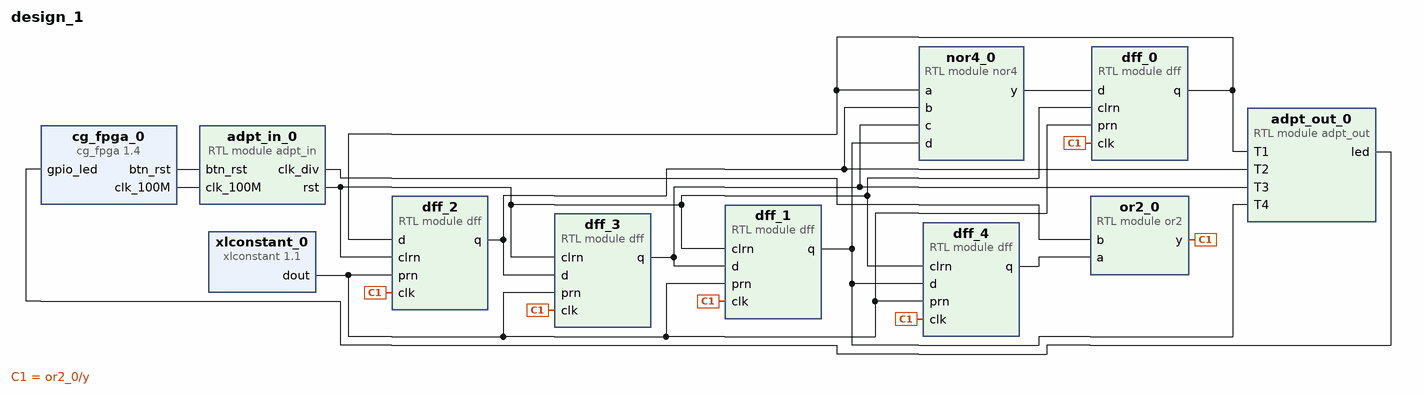
[diagram p0: block diagram of the top level]
# Vivado block design design_1, xc7z020clg400-1, Vivado 2024.2
create_bd_design design_1

create_bd_cell -type ip -vlnv educg.net:user:cg_fpga:1.4 cg_fpga_0
create_bd_cell -type module -reference adpt_in adpt_in_0
create_bd_cell -type module -reference dff dff_0
create_bd_cell -type module -reference dff dff_1
create_bd_cell -type module -reference dff dff_2
create_bd_cell -type module -reference dff dff_3
create_bd_cell -type module -reference adpt_out adpt_out_0
create_bd_cell -type ip -vlnv xilinx.com:ip:xlconstant:1.1 xlconstant_0
create_bd_cell -type module -reference nor4 nor4_0
create_bd_cell -type module -reference or2 or2_0
create_bd_cell -type module -reference dff dff_4

# ---- connections ----

connect_bd_net [get_bd_pins adpt_in_0/clk_div] [get_bd_pins or2_0/b]
connect_bd_net [get_bd_pins adpt_in_0/rst] \
  [get_bd_pins dff_2/clrn] [get_bd_pins dff_3/clrn] [get_bd_pins dff_1/clrn] [get_bd_pins dff_4/clrn] \
  [get_bd_pins dff_0/clrn]
connect_bd_net [get_bd_pins adpt_out_0/led] [get_bd_pins cg_fpga_0/gpio_led]
connect_bd_net [get_bd_pins cg_fpga_0/btn_rst] [get_bd_pins adpt_in_0/btn_rst]
connect_bd_net [get_bd_pins cg_fpga_0/clk_100M] [get_bd_pins adpt_in_0/clk_100M]
connect_bd_net [get_bd_pins dff_0/q] [get_bd_pins dff_2/d] [get_bd_pins adpt_out_0/T1] [get_bd_pins nor4_0/a]
connect_bd_net [get_bd_pins dff_1/q] [get_bd_pins adpt_out_0/T4] [get_bd_pins dff_4/d] [get_bd_pins nor4_0/d]
connect_bd_net [get_bd_pins dff_2/q] [get_bd_pins dff_3/d] [get_bd_pins adpt_out_0/T2] [get_bd_pins nor4_0/b]
connect_bd_net [get_bd_pins dff_3/q] [get_bd_pins dff_1/d] [get_bd_pins adpt_out_0/T3] [get_bd_pins nor4_0/c]
connect_bd_net [get_bd_pins dff_4/q] [get_bd_pins or2_0/a]
connect_bd_net [get_bd_pins nor4_0/y] [get_bd_pins dff_0/d]
connect_bd_net [get_bd_pins or2_0/y] \
  [get_bd_pins dff_0/clk] [get_bd_pins dff_2/clk] [get_bd_pins dff_3/clk] [get_bd_pins dff_1/clk] [get_bd_pins dff_4/clk]
connect_bd_net [get_bd_pins xlconstant_0/dout] \
  [get_bd_pins dff_2/prn] [get_bd_pins dff_3/prn] [get_bd_pins dff_1/prn] [get_bd_pins dff_0/prn] [get_bd_pins dff_4/prn]

validate_bd_design
save_bd_design
